# Altium schematic sheet fpga_io_bank_2_fmc.SchDoc: FPGA bank 2
size 209 x 297 mm; CheckedBy: MC, TW, EB; CompanyName: CERN; DrawnBy: Greg Kasprowicz; Organization: CERN; Address1: European Organization for Nuclear Research; Address2: CH-1211 Geneve 23 - Switzerland; DocumentNumber: 7; Revision: -; SheetNumber: 7; SheetTotal: 17; EDA_Number: EDA-02189-V4-0; Projet: Simple PCIe Carrier Board; ModifiedBy: TW, MC; CreateDate: 10/07/2010; CheckedDate: 11/05/2011; Title2: FMC connections; DivGrp: BE-CO; Designer: GK, MC, TW, EB, PAS; DocumentName: fpga_io_bank_2_fmc.SchDoc; ModifiedDate: -
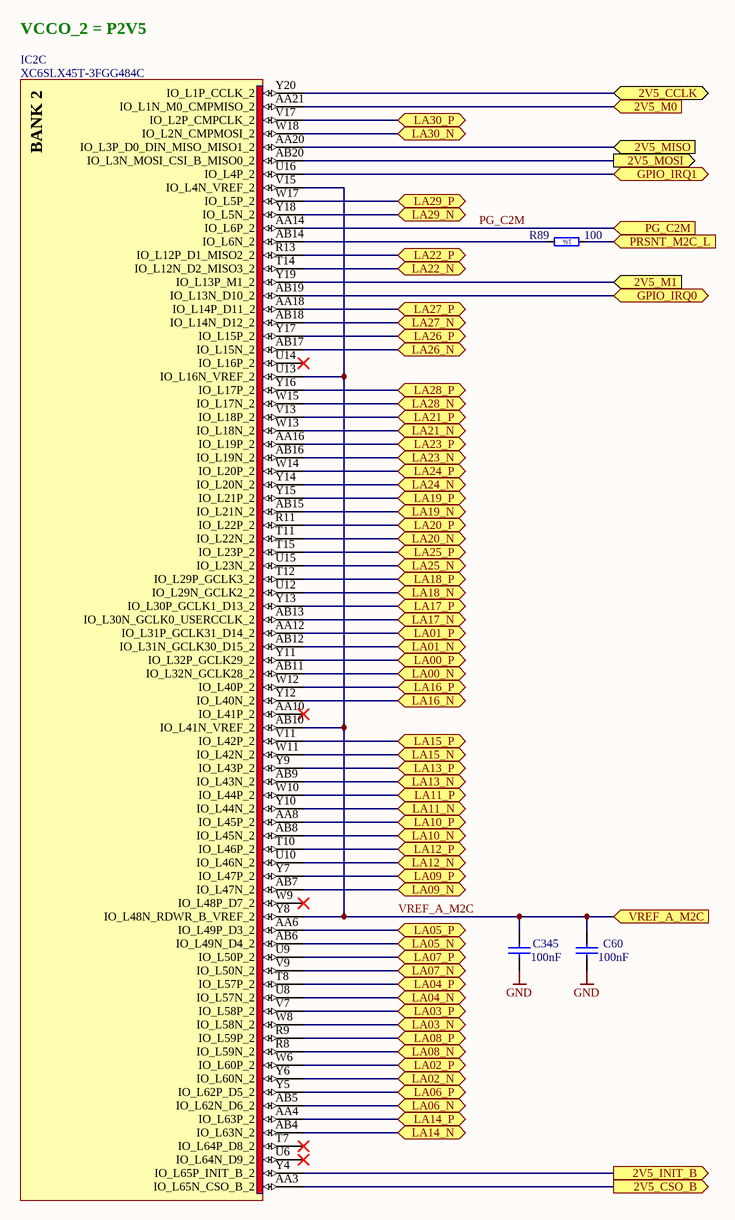
[diagram p0: fpga_io_bank_2_fmc.SchDoc]

## Parts
C60  100nF  [CAPC1005X55N]
C345  100nF  [CAPC1005X55N]
IC2  XC6SLX45T-3FGG484C  [BGA484C100P22X22_2300X2300X260]  (part C of 9)
R89  100  [RESC1608X55N]

## Ports
2V5_CCLK (bidir), 2V5_CSO_B (out), 2V5_INIT_B (out), 2V5_M0 (in), 2V5_M1 (in), 2V5_MISO (in), 2V5_MOSI (out), GPIO_IRQ0 (bidir), GPIO_IRQ1 (bidir), LA00_N (bidir), LA00_P (bidir), LA01_N (bidir), LA01_P (bidir), LA02_N (bidir), LA02_P (bidir), LA03_N (bidir), LA03_P (bidir), LA04_N (bidir), LA04_P (bidir), LA05_N (bidir), LA05_P (bidir), LA06_N (bidir), LA06_P (bidir), LA07_N (bidir), LA07_P (bidir), LA08_N (bidir), LA08_P (bidir), LA09_N (bidir), LA09_P (bidir), LA10_N (bidir), LA10_P (bidir), LA11_N (bidir), LA11_P (bidir), LA12_N (bidir), LA12_P (bidir), LA13_N (bidir), LA13_P (bidir), LA14_N (bidir), LA14_P (bidir), LA15_N (bidir), LA15_P (bidir), LA16_N (bidir), LA16_P (bidir), LA17_N (bidir), LA17_P (bidir), LA18_N (bidir), LA18_P (bidir), LA19_N (bidir), LA19_P (bidir), LA20_N (bidir), LA20_P (bidir), LA21_N (bidir), LA21_P (bidir), LA22_N (bidir), LA22_P (bidir), LA23_N (bidir), LA23_P (bidir), LA24_N (bidir), LA24_P (bidir), LA25_N (bidir), LA25_P (bidir), LA26_N (bidir), LA26_P (bidir), LA27_N (bidir), LA27_P (bidir), LA28_N (bidir), LA28_P (bidir), LA29_N (bidir), LA29_P (bidir), LA30_N (bidir), LA30_P (bidir), PG_C2M (in), PRSNT_M2C_L (in), VREF_A_M2C (in)

## Nets
GND: C60.1 C345.1
2V5_CCLK: IC2.Y20(IO_L1P_CCLK_2) ; port 2V5_CCLK
2V5_CSO_B: IC2.AA3(IO_L65N_CSO_B_2) ; port 2V5_CSO_B
2V5_INIT_B: IC2.Y4(IO_L65P_INIT_B_2) ; port 2V5_INIT_B
2V5_M0: IC2.AA21(IO_L1N_M0_CMPMISO_2) ; port 2V5_M0
2V5_M1: IC2.Y19(IO_L13P_M1_2) ; port 2V5_M1
2V5_MISO: IC2.AA20(IO_L3P_D0_DIN_MISO_MISO1_2) ; port 2V5_MISO
2V5_MOSI: IC2.AB20(IO_L3N_MOSI_CSI_B_MISO0_2) ; port 2V5_MOSI
GPIO_IRQ0: IC2.AB19(IO_L13N_D10_2) ; port GPIO_IRQ0
GPIO_IRQ1: IC2.U16(IO_L4P_2) ; port GPIO_IRQ1
LA00_N: IC2.AB11(IO_L32N_GCLK28_2) ; port LA00_N
LA00_P: IC2.Y11(IO_L32P_GCLK29_2) ; port LA00_P
LA01_N: IC2.AB12(IO_L31N_GCLK30_D15_2) ; port LA01_N
LA01_P: IC2.AA12(IO_L31P_GCLK31_D14_2) ; port LA01_P
LA02_N: IC2.Y6(IO_L60N_2) ; port LA02_N
LA02_P: IC2.W6(IO_L60P_2) ; port LA02_P
LA03_N: IC2.W8(IO_L58N_2) ; port LA03_N
LA03_P: IC2.V7(IO_L58P_2) ; port LA03_P
LA04_N: IC2.U8(IO_L57N_2) ; port LA04_N
LA04_P: IC2.T8(IO_L57P_2) ; port LA04_P
LA05_N: IC2.AB6(IO_L49N_D4_2) ; port LA05_N
LA05_P: IC2.AA6(IO_L49P_D3_2) ; port LA05_P
LA06_N: IC2.AB5(IO_L62N_D6_2) ; port LA06_N
LA06_P: IC2.Y5(IO_L62P_D5_2) ; port LA06_P
LA07_N: IC2.V9(IO_L50N_2) ; port LA07_N
LA07_P: IC2.U9(IO_L50P_2) ; port LA07_P
LA08_N: IC2.R8(IO_L59N_2) ; port LA08_N
LA08_P: IC2.R9(IO_L59P_2) ; port LA08_P
LA09_N: IC2.AB7(IO_L47N_2) ; port LA09_N
LA09_P: IC2.Y7(IO_L47P_2) ; port LA09_P
LA10_N: IC2.AB8(IO_L45N_2) ; port LA10_N
LA10_P: IC2.AA8(IO_L45P_2) ; port LA10_P
LA11_N: IC2.Y10(IO_L44N_2) ; port LA11_N
LA11_P: IC2.W10(IO_L44P_2) ; port LA11_P
LA12_N: IC2.U10(IO_L46N_2) ; port LA12_N
LA12_P: IC2.T10(IO_L46P_2) ; port LA12_P
LA13_N: IC2.AB9(IO_L43N_2) ; port LA13_N
LA13_P: IC2.Y9(IO_L43P_2) ; port LA13_P
LA14_N: IC2.AB4(IO_L63N_2) ; port LA14_N
LA14_P: IC2.AA4(IO_L63P_2) ; port LA14_P
LA15_N: IC2.W11(IO_L42N_2) ; port LA15_N
LA15_P: IC2.V11(IO_L42P_2) ; port LA15_P
LA16_N: IC2.Y12(IO_L40N_2) ; port LA16_N
LA16_P: IC2.W12(IO_L40P_2) ; port LA16_P
LA17_N: IC2.AB13(IO_L30N_GCLK0_USERCCLK_2) ; port LA17_N
LA17_P: IC2.Y13(IO_L30P_GCLK1_D13_2) ; port LA17_P
LA18_N: IC2.U12(IO_L29N_GCLK2_2) ; port LA18_N
LA18_P: IC2.T12(IO_L29P_GCLK3_2) ; port LA18_P
LA19_N: IC2.AB15(IO_L21N_2) ; port LA19_N
LA19_P: IC2.Y15(IO_L21P_2) ; port LA19_P
LA20_N: IC2.T11(IO_L22N_2) ; port LA20_N
LA20_P: IC2.R11(IO_L22P_2) ; port LA20_P
LA21_N: IC2.W13(IO_L18N_2) ; port LA21_N
LA21_P: IC2.V13(IO_L18P_2) ; port LA21_P
LA22_N: IC2.T14(IO_L12N_D2_MISO3_2) ; port LA22_N
LA22_P: IC2.R13(IO_L12P_D1_MISO2_2) ; port LA22_P
LA23_N: IC2.AB16(IO_L19N_2) ; port LA23_N
LA23_P: IC2.AA16(IO_L19P_2) ; port LA23_P
LA24_N: IC2.Y14(IO_L20N_2) ; port LA24_N
LA24_P: IC2.W14(IO_L20P_2) ; port LA24_P
LA25_N: IC2.U15(IO_L23N_2) ; port LA25_N
LA25_P: IC2.T15(IO_L23P_2) ; port LA25_P
LA26_N: IC2.AB17(IO_L15N_2) ; port LA26_N
LA26_P: IC2.Y17(IO_L15P_2) ; port LA26_P
LA27_N: IC2.AB18(IO_L14N_D12_2) ; port LA27_N
LA27_P: IC2.AA18(IO_L14P_D11_2) ; port LA27_P
LA28_N: IC2.W15(IO_L17N_2) ; port LA28_N
LA28_P: IC2.Y16(IO_L17P_2) ; port LA28_P
LA29_N: IC2.Y18(IO_L5N_2) ; port LA29_N
LA29_P: IC2.W17(IO_L5P_2) ; port LA29_P
LA30_N: IC2.W18(IO_L2N_CMPMOSI_2) ; port LA30_N
LA30_P: IC2.V17(IO_L2P_CMPCLK_2) ; port LA30_P
PG_C2M: IC2.AA14(IO_L6P_2) ; port PG_C2M
PRSNT_M2C_L: R89.1 ; port PRSNT_M2C_L
VREF_A_M2C: C60.2 C345.2 IC2.AB10(IO_L41N_VREF_2) IC2.U13(IO_L16N_VREF_2) IC2.V15(IO_L4N_VREF_2) IC2.Y8(IO_L48N_RDWR_B_VREF_2) ; port VREF_A_M2C
NetIC2_AB14: IC2.AB14(IO_L6N_2) R89.2

Not connected (* = marked no-connect by the designer): IC2 AA10(IO_L41P_2)* T7(IO_L64P_D8_2)* U6(IO_L64N_D9_2)* U14(IO_L16P_2)* W9(IO_L48P_D7_2)*

## Notes on the sheet
- VCCO_2 = P2V5
- Project/Equipment
- Document
- Designer
- Drawn by
- Check.by
- File
- Last Mod.
- Print Date
- Sheet
- Size
- A4
- of
- Rev
- (in symbol R0603_100R_1%_0.1W_100PPM) 1%
- (in symbol XC6SLX45T-3FGG484C, part C) BANK 2

## Library data of the parts
C60 C345 = CC0402_100NF_16V_10%_X7R: Non-polarised capacitor; Part Description: SMD Multilayer Chip Ceramic Capacitor; Manufacturer: GENERIC; Manufacturer1 Part Number: 223878715649; Voltage: 16V; TC: X7R; Tolerance: ±10%; Table: Capacitors SMD; Part Number: CC0402_100NF_16V_10%_X7R; Component Kind: Standard; Component Type: Standard; Pin Count: 2; Value: 100nF; Status: Not Recommended; Manufacturer Part Number: CC0402_100NF_16V_10%_X7R; Case: 0402; Mounted: Yes; Socket: No; SMD: Yes; Manufacturer1 Example: PHYCOMP; Manufacturer1 ComponentHeight: 0.55mm; HelpURL: \\cern.ch\dfs\Applications\Altium\Datasheets\CC0402_X7R_PHYCOMP.pdf; Author: CERN DEM JLC; CreateDate: 12/3/2007; LatestRevisionDate: 12/3/2007
IC2 = XC6SLX45T-3FGG484C: Spartan-6 LXT 1.2V FPGA, 296 User I/Os, 484-Ball Fine-Pitch BGA (1.0mm Pitch), Speed Grade 3, Commercial Grade, Pb-Free; Manufacturer: XILINX; Table: Logic; Part Number: XC6SLX45T-3FGG484C; Component Kind: Standard; Component Type: Standard; Device: XC6SLX45T-3FGG484C; PackageDescription: BGA,1.00mm pitch,square;484 pin,22 columns X 22 rows,23.00mm X 23.00mm X 2.60mm H; Part Description: Spartan-6 LXT 1.2V FPGA, 296 User I/Os, 484-Ball Fine-Pitch BGA (1.0mm Pitch), Speed Grade 3, Commercial Grade, Pb-Free; Manufacturer Part Number: XC6SLX45T-3FGG484C; Pin Count: 484; Case: BGA484; Mounted: Yes; Socket: No; SMD: Yes; ComponentHeight: 2.6mm; HelpURL: \\cern.ch\dfs\Applications\Altium\Datasheets\XC6SLX45T-3FGG484C.pdf; ComponentLink1URL: \\cern.ch\dfs\Applications\Altium\Datasheets\XC6SLX45T-3FGG484C_Package-Pinouts.pdf; ComponentLink1Description: Package/Pinouts; Author: CERN DEM JLC; CreateDate: 2010-07-08; LatestRevisionDate: 2010-07-08
R89 = R0603_100R_1%_0.1W_100PPM: Resistor - 1%; Part Description: General Purpose Thick Film Chip Resistor; Manufacturer: GENERIC; Manufacturer1 Part Number: NRC06F4700TRF; Power: 0.1W; TC: ±100ppm/°C; Table: Resistors SMD; Part Number: R0603_100R_1%_0.1W_100PPM; Component Kind: Standard; Component Type: Standard; Pin Count: 2; Value: 100; Status: Preferred; Tolerance: ±1%; Manufacturer Part Number: R0603_100R_1%_0.1W_100PPM; Case: 0603; Mounted: Yes; Socket: No; SMD: Yes; Manufacturer1 Example: NIC COMPONENT; Manufacturer1 ComponentHeight: 0.55mm; HelpURL: \\cern.ch\dfs\Applications\Altium\Datasheets\R0603_NIC_NRC.pdf; Author: CERN DEM JLC; CreateDate: 2007-12-03; LatestRevisionDate: 2008-03-13